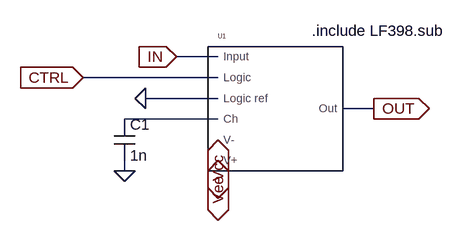
[diagram p0: schematic sh.asc]
sh.asc, the LTspice schematic file:
Version 4
SHEET 1 880 680
WIRE -224 96 -288 96
WIRE -224 128 -432 128
WIRE -224 160 -336 160
WIRE 16 176 -32 176
WIRE -224 192 -368 192
WIRE -368 272 -368 256
FLAG -288 96 IN
IOPIN -288 96 In
FLAG 16 176 OUT
IOPIN 16 176 Out
FLAG -336 160 0
FLAG -368 272 0
FLAG -224 256 Vee
IOPIN -224 256 BiDir
FLAG -224 224 Vcc
IOPIN -224 224 BiDir
FLAG -432 128 CTRL
IOPIN -432 128 In
SYMBOL lf398 -160 144 R0
SYMATTR InstName U1
SYMBOL cap -384 192 R0
SYMATTR InstName C1
SYMATTR Value 1n
TEXT -80 56 Left 2 !.include LF398.sub

The netlist it stands for:
* sh.asc
XU1 IN CTRL 0 Vcc N001 OUT Vee LF398H  ; pins Input Logic Logic_ref V- Ch Out V+
C1 N001 0 1n
.include LF398.sub
.backanno
.end